# Altium schematic sheet CPLD.SchDoc: {Наименование}
size 420 x 297 mm; DocumentNumber: НРДЦ.ХХХХХХ.ХХХ ХХ; SheetNumber: {}; SheetTotal: {}; PageSetup: Record=PageOptions|CenterHorizontal=False|CenterVertical=False|PrintScale=0.95|XCorrection=0.00|YCorrection=0.00|PrintKind=1|BorderSize=5000000|LeftOffset=0|BottomOffset=0|Orientation=1|PaperLength=1000|PaperWidth=1000|Scale=100|PaperSource=15|PrintQuality=600|MediaType=1|DitherType=10|PaperKind=A4|PrintScaleMode=1; Rule: PcbType=ProtelPcb
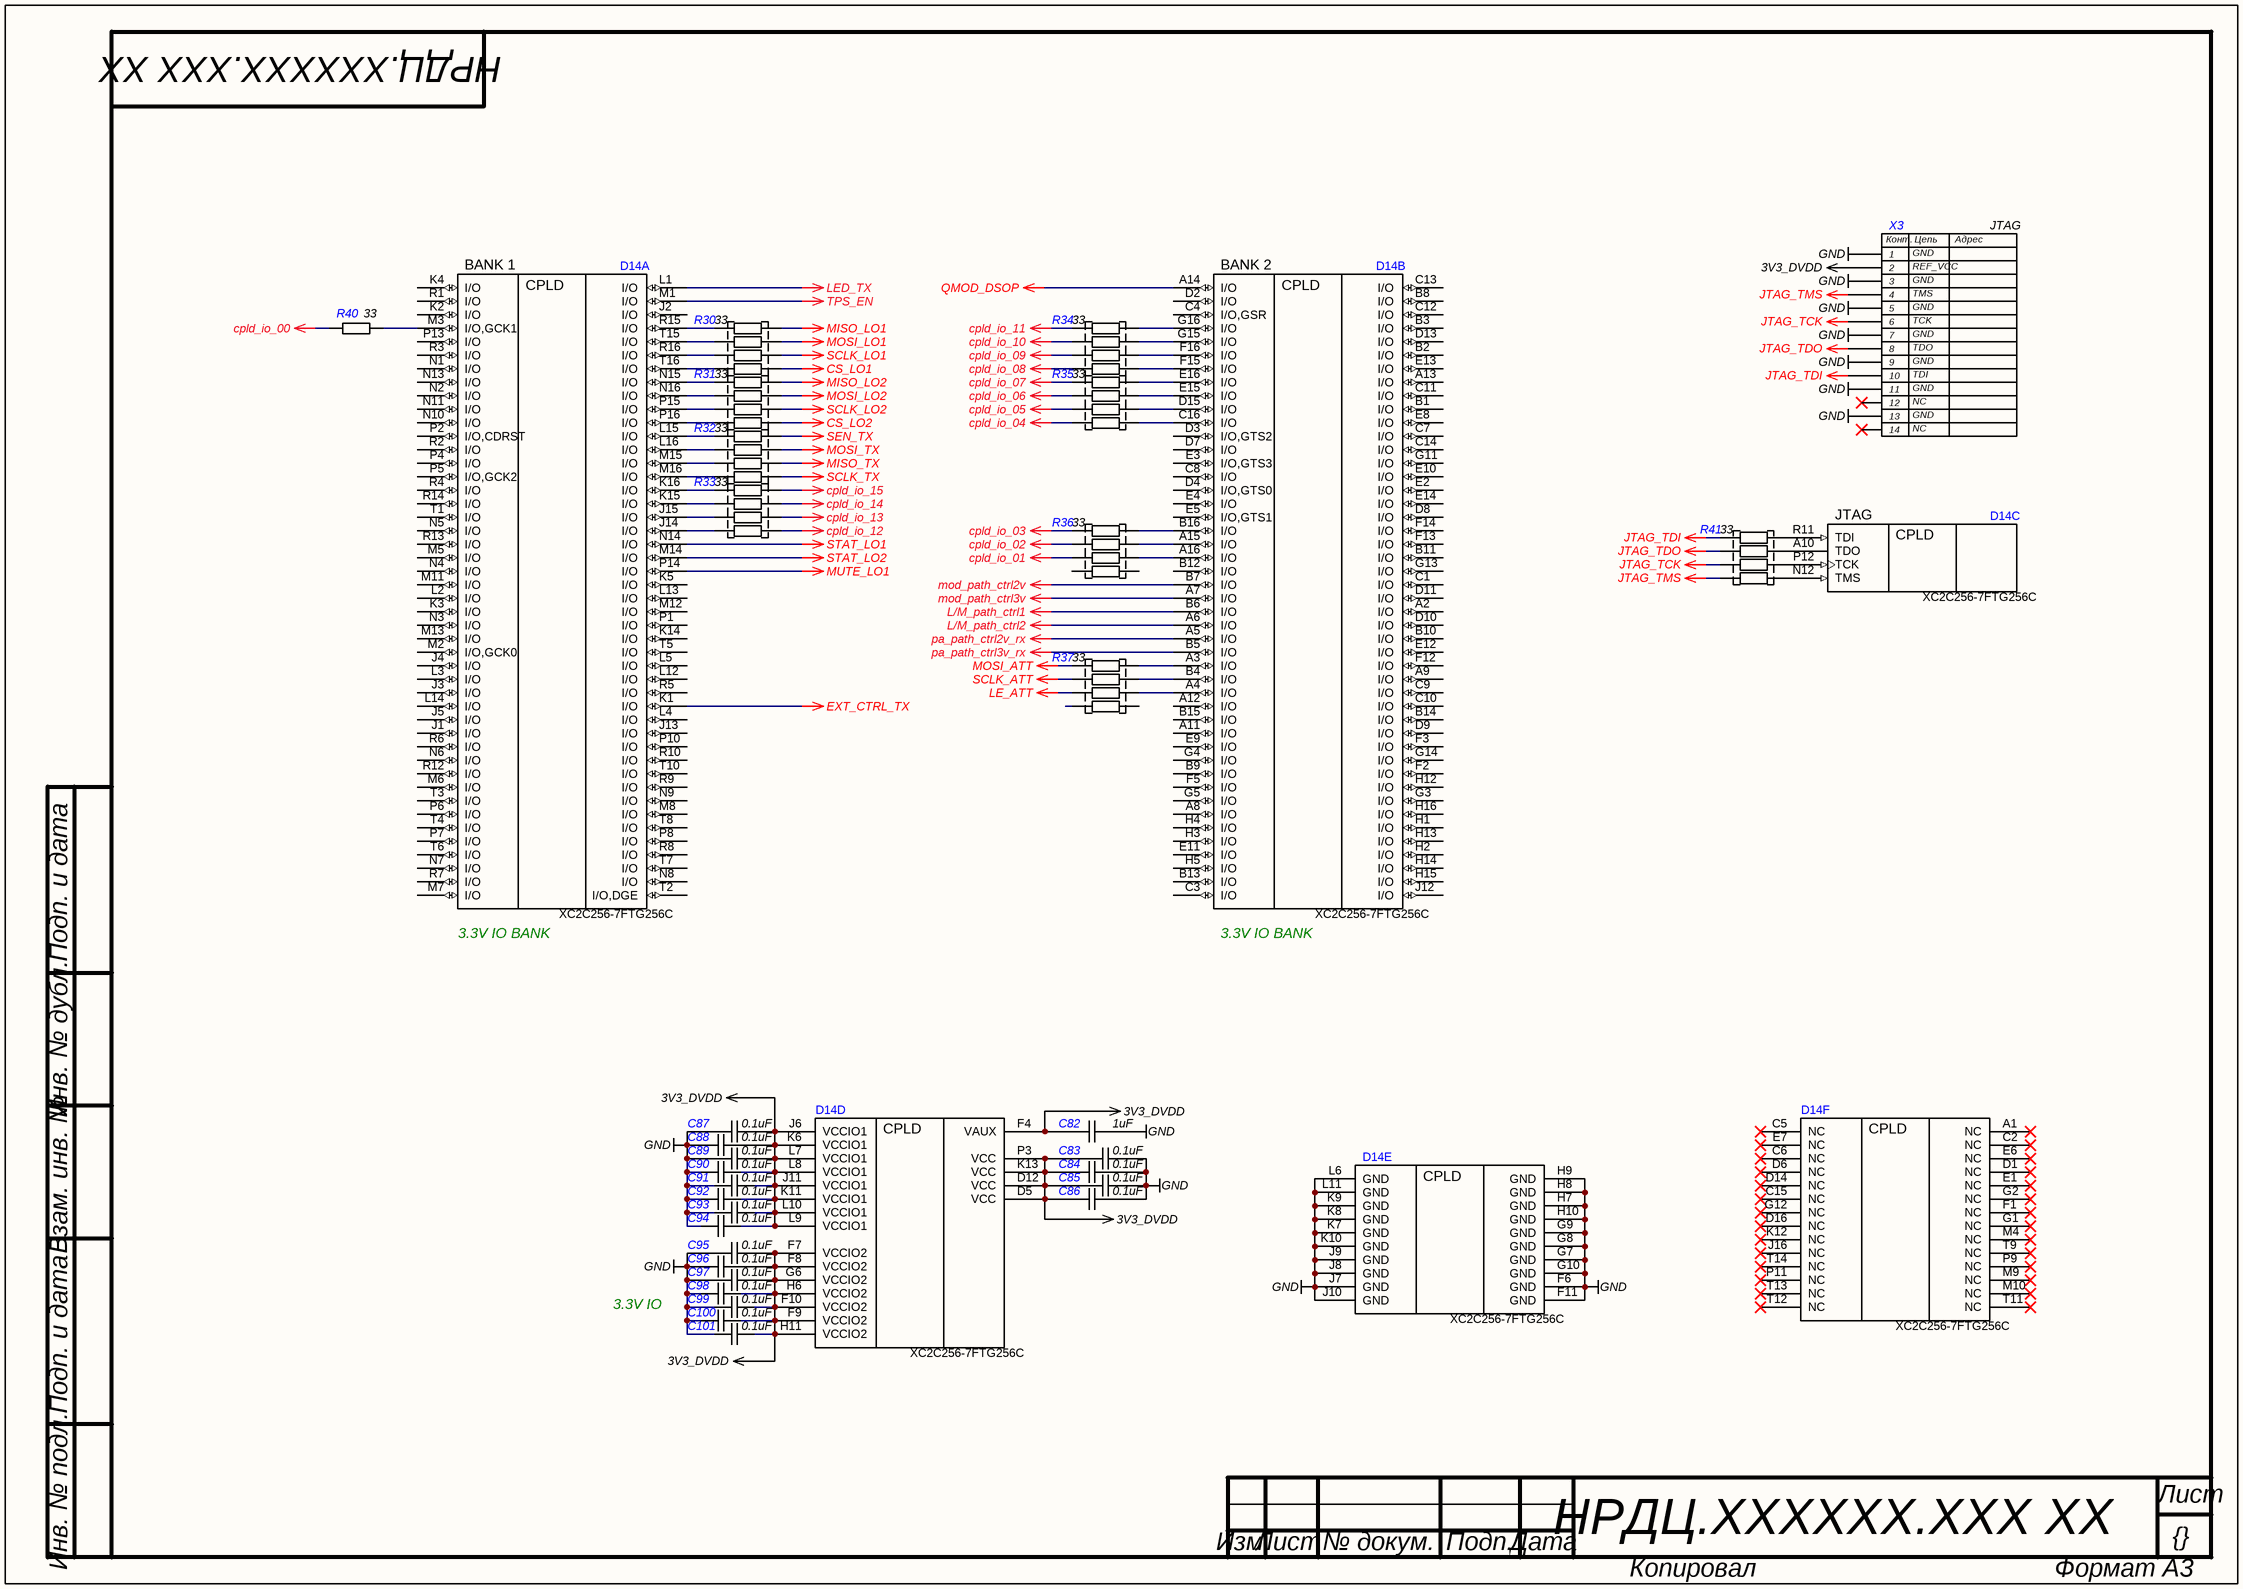
[diagram p0: CPLD.SchDoc]

## Parts
C82  value 1uF  [C0402]  (hidden comment: CAP)
C83  value 0.1uF  [C0402]  (hidden comment: CAP)
C84  value 0.1uF  [C0402]  (hidden comment: CAP)
C85  value 0.1uF  [C0402]  (hidden comment: CAP)
C86  value 0.1uF  [C0402]  (hidden comment: CAP)
C87  value 0.1uF  [C0402]  (hidden comment: CAP)
C88  value 0.1uF  [C0402]  (hidden comment: CAP)
C89  value 0.1uF  [C0402]  (hidden comment: CAP)
C90  value 0.1uF  [C0402]  (hidden comment: CAP)
C91  value 0.1uF  [C0402]  (hidden comment: CAP)
C92  value 0.1uF  [C0402]  (hidden comment: CAP)
C93  value 0.1uF  [C0402]  (hidden comment: CAP)
C94  value 0.1uF  [C0402]  (hidden comment: CAP)
C95  value 0.1uF  [C0402]  (hidden comment: CAP)
C96  value 0.1uF  [C0402]  (hidden comment: CAP)
C97  value 0.1uF  [C0402]  (hidden comment: CAP)
C98  value 0.1uF  [C0402]  (hidden comment: CAP)
C99  value 0.1uF  [C0402]  (hidden comment: CAP)
C100  value 0.1uF  [C0402]  (hidden comment: CAP)
C101  value 0.1uF  [C0402]  (hidden comment: CAP)
D14  XC2C256-7FTG256C  [FTG256]  (parts A,B,C,D,E,F of 6)
R30  value 33  [EXN8V]  (hidden comment: RES 4x0402)
R31  value 33  [EXN8V]  (hidden comment: RES 4x0402)
R32  value 33  [EXN8V]  (hidden comment: RES 4x0402)
R33  value 33  [EXN8V]  (hidden comment: RES 4x0402)
R34  value 33  [EXN8V]  (hidden comment: RES 4x0402)
R35  value 33  [EXN8V]  (hidden comment: RES 4x0402)
R36  value 33  [EXN8V]  (hidden comment: RES 4x0402)
R37  value 33  [EXN8V]  (hidden comment: RES 4x0402)
R40  value 33  [R0402]  (hidden comment: RES)
R41  value 33  [EXN8V]  (hidden comment: RES 4x0402)
X3  JTAG  [JTAG Mail 2mm]

## Nets
3V3_DVDD: C82.1 C83.1 C84.1 C85.1 C86.1 C87.2 C88.2 C89.2 C90.2 C91.2 C92.2 C93.2 C94.2 C95.2 C96.2 C97.2 C98.2 C99.2 C100.2 C101.2 D14.D5(VCC) D14.D12(VCC) D14.F4(VAUX) D14.F7(VCCIO2) D14.F8(VCCIO2) D14.F9(VCCIO2) D14.F10(VCCIO2) D14.G6(VCCIO2) D14.H6(VCCIO2) D14.H11(VCCIO2) D14.J6(VCCIO1) D14.J11(VCCIO1) D14.K6(VCCIO1) D14.K11(VCCIO1) D14.K13(VCC) D14.L7(VCCIO1) D14.L8(VCCIO1) D14.L9(VCCIO1) D14.L10(VCCIO1) D14.P3(VCC) X3.2
cpld_io_00: R40.2
cpld_io_01: R36.7
cpld_io_02: R36.6
cpld_io_03: R36.5
cpld_io_04: R35.8
cpld_io_05: R35.7
cpld_io_06: R35.6
cpld_io_07: R35.5
cpld_io_08: R34.8
cpld_io_09: R34.7
cpld_io_10: R34.6
cpld_io_11: R34.5
cpld_io_12: R33.8
cpld_io_13: R33.7
cpld_io_14: R33.6
cpld_io_15: R33.5
CS_LO1: R30.5
CS_LO2: R31.5
EXT_CTRL_TX: D14.K1(I/O)
GND: C82.2 C83.2 C84.2 C85.2 C86.2 C87.1 C88.1 C89.1 C90.1 C91.1 C92.1 C93.1 C94.1 C95.1 C96.1 C97.1 C98.1 C99.1 C100.1 C101.1 D14.F6(GND) D14.F11(GND) D14.G7(GND) D14.G8(GND) D14.G9(GND) D14.G10(GND) D14.H7(GND) D14.H8(GND) D14.H9(GND) D14.H10(GND) D14.J7(GND) D14.J8(GND) D14.J9(GND) D14.J10(GND) D14.K7(GND) D14.K8(GND) D14.K9(GND) D14.K10(GND) D14.L6(GND) D14.L11(GND) X3.1 X3.3 X3.5 X3.7 X3.9 X3.11 X3.13
JTAG_TCK: R41.6 X3.6
JTAG_TDI: R41.8 X3.10
JTAG_TDO: R41.7 X3.8
JTAG_TMS: R41.5 X3.4
L/M_path_ctrl1: D14.B6(I/O)
L/M_path_ctrl2: D14.A6(I/O)
LE_ATT: R37.6
LED_TX: D14.L1(I/O)
MISO_LO1: R30.8
MISO_LO2: R31.8
MISO_TX: R32.6
mod_path_ctrl2v: D14.B7(I/O)
mod_path_ctrl3v: D14.A7(I/O)
MOSI_ATT: R37.8
MOSI_LO1: R30.7
MOSI_LO2: R31.7
MOSI_TX: R32.7
MUTE_LO1: D14.P14(I/O)
pa_path_ctrl2v_rx: D14.A5(I/O)
pa_path_ctrl3v_rx: D14.B5(I/O)
QMOD_DSOP: D14.A14(I/O)
SCLK_ATT: R37.7
SCLK_LO1: R30.6
SCLK_LO2: R31.6
SCLK_TX: R32.5
SEN_TX: R32.8
STAT_LO1: D14.N14(I/O)
STAT_LO2: D14.M14(I/O)
TPS_EN: D14.M1(I/O)
NetD14_A3: D14.A3(I/O) R37.1
NetD14_A4: D14.A4(I/O) R37.3
NetD14_A10: D14.A10(TDO) R41.2
NetD14_A15: D14.A15(I/O) R36.3
NetD14_A16: D14.A16(I/O) R36.2
NetD14_B4: D14.B4(I/O) R37.2
NetD14_B16: D14.B16(I/O) R36.4
NetD14_C16: D14.C16(I/O) R35.1
NetD14_D15: D14.D15(I/O) R35.2
NetD14_E15: D14.E15(I/O) R35.3
NetD14_E16: D14.E16(I/O) R35.4
NetD14_F15: D14.F15(I/O) R34.1
NetD14_F16: D14.F16(I/O) R34.2
NetD14_G15: D14.G15(I/O) R34.3
NetD14_G16: D14.G16(I/O) R34.4
NetD14_J14: D14.J14(I/O) R33.1
NetD14_J15: D14.J15(I/O) R33.2
NetD14_K15: D14.K15(I/O) R33.3
NetD14_K16: D14.K16(I/O) R33.4
NetD14_L15: D14.L15(I/O) R32.1
NetD14_L16: D14.L16(I/O) R32.2
NetD14_M3: D14.M3(I/O,GCK1) R40.1
NetD14_M15: D14.M15(I/O) R32.3
NetD14_M16: D14.M16(I/O) R32.4
NetD14_N12: D14.N12(TMS) R41.4
NetD14_N15: D14.N15(I/O) R31.1
NetD14_N16: D14.N16(I/O) R31.2
NetD14_P12: D14.P12(TCK) R41.3
NetD14_P15: D14.P15(I/O) R31.3
NetD14_P16: D14.P16(I/O) R31.4
NetD14_R11: D14.R11(TDI) R41.1
NetD14_R15: D14.R15(I/O) R30.1
NetD14_R16: D14.R16(I/O) R30.2
NetD14_T15: D14.T15(I/O) R30.3
NetD14_T16: D14.T16(I/O) R30.4

Not connected (* = marked no-connect by the designer): D14 A1(NC)* A2(I/O) A8(I/O) A9(I/O) A11(I/O) A12(I/O) A13(I/O) B1(I/O) B2(I/O) B3(I/O) B8(I/O) B9(I/O) B10(I/O) B11(I/O) B12(I/O) B13(I/O) B14(I/O) B15(I/O) C1(I/O) C2(NC)* C3(I/O) C4(I/O,GSR) C5(NC)* C6(NC)* C7(I/O) C8(I/O) C9(I/O) C10(I/O) C11(I/O) C12(I/O) C13(I/O) C14(I/O) C15(NC)* D1(NC)* D2(I/O) D3(I/O,GTS2) D4(I/O,GTS0) D6(NC)* D7(I/O) D8(I/O) D9(I/O) D10(I/O) D11(I/O) D13(I/O) D14(NC)* D16(NC)* E1(NC)* E2(I/O) E3(I/O,GTS3) E4(I/O) E5(I/O,GTS1) E6(NC)* E7(NC)* E8(I/O) E9(I/O) E10(I/O) E11(I/O) E12(I/O) E13(I/O) E14(I/O) F1(NC)* F2(I/O) F3(I/O) F5(I/O) F12(I/O) F13(I/O) F14(I/O) G1(NC)* G2(NC)* G3(I/O) G4(I/O) G5(I/O) G11(I/O) G12(NC)* G13(I/O) G14(I/O) H1(I/O) H2(I/O) H3(I/O) H4(I/O) H5(I/O) H12(I/O) H13(I/O) H14(I/O) H15(I/O) H16(I/O) J1(I/O) J2(I/O) J3(I/O) J4(I/O) J5(I/O) J12(I/O) J13(I/O) J16(NC)* K2(I/O) K3(I/O) K4(I/O) K5(I/O) K12(NC)* K14(I/O) L2(I/O) L3(I/O) L4(I/O) L5(I/O) L12(I/O) L13(I/O) L14(I/O) M2(I/O,GCK0) M4(NC)* M5(I/O) M6(I/O) M7(I/O) M8(I/O) M9(NC)* M10(NC)* M11(I/O) M12(I/O) M13(I/O) N1(I/O) N2(I/O) N3(I/O) N4(I/O) N5(I/O) N6(I/O) N7(I/O) N8(I/O) N9(I/O) N10(I/O) N11(I/O) N13(I/O) P1(I/O) P2(I/O,CDRST) P4(I/O) P5(I/O,GCK2) P6(I/O) P7(I/O) P8(I/O) P9(NC)* P10(I/O) P11(NC)* P13(I/O) R1(I/O) R2(I/O) R3(I/O) R4(I/O) R5(I/O) R6(I/O) R7(I/O) R8(I/O) R9(I/O) R10(I/O) R12(I/O) R13(I/O) R14(I/O) T1(I/O) T2(I/O,DGE) T3(I/O) T4(I/O) T5(I/O) T6(I/O) T7(I/O) T8(I/O) T9(NC)* T10(I/O) T11(NC)* T12(NC)* T13(NC)* T14(NC)*; R36 1 8; R37 4 5; X3 12* 14*

## Notes on the sheet
- (near X3) GND
- (near X3) REF_VCC
- (near X3) TMS
- (near X3) TCK
- (near X3) TDO
- (near X3) TDI
- (near X3) NC
- (near D14) 3.3V IO BANK
- 3.3V IO
- Подп. и дата
- Инв. № дубл.
- Взам. инв. №
- Инв. № подл.
- Лист
- Изм.
- № докум.
- Подп.
- Дата
- Копировал
- Формат А3
- (in symbol HDR Debug_14-pin) Конт.; Цепь; Адрес
- (in symbol XC2C256-7FTG256C, part A) BANK 1
- (in symbol XC2C256-7FTG256C, part B) BANK 2
- (in symbol XC2C256-7FTG256C, part C) JTAG

## Library data of the parts
C82 = CAP: SMD Capacitor; Manufacturer: Murata; Material: X7R; Tolerance: 10%; Voltage: 6.3V; Type: Ceramic Capacitor; P/N: GRM155R70J105KA12J; Supplier 1: Digi-key; Supplier Part Number 1: 490-13339-1-ND; Supplier 2: Mouser; Supplier Part Number 2: 81-GRM155R70J105KA2J; Supplier 3: Farnell; Supplier Part Number 3: *
C83-C101 = CAP: SMD Capacitor; Manufacturer: Murata; Material: X7R; Tolerance: 10%; Voltage: 10V; Type: Ceramic Capacitor; P/N: GRM155R71A104KA01J; Supplier 1: Digi-key; Supplier Part Number 1: 490-6322-1-ND; Supplier 2: Mouser; Supplier Part Number 2: 81-GRM155R71A104KA1J; Supplier 3: Farnell; Supplier Part Number 3: *
D14 = XC2C256-7FTG256C: CoolRunner-II 1.8V, 256 Macrocell CPLD, 184 User I/Os, 256-Ball FTBGA, Commercial Grade, Pb-Free; Code_JEDEC: MS-034-AAF-1*; PackageVersion: ver1.3, Oct-2007; PackageReference: FTG256; PackageDescription: 256-Ball Fine Pitch Thin Ball Grid Array 1.00 mm Pitch (FTG256) - Pb-Free; DatasheetVersion: ver3.2, Mar-2007; PartNumber: XC2C256-7FTG256C; P/N: XC2C256-7FTG256C; Name: XC2C256-7FTG256C; Type: CPLD; Supplier 1: Digi-key; Supplier Part Number 1: 122-1400-ND; Supplier 2: Mouser; Supplier Part Number 2: 217-XC2C256-7FTG256C; Supplier 3: Farnell; Supplier Part Number 3: *
R30-R37 R41 = RES 4x0402: Chip Resistor Array; Manufacturer: Panasonic; Name: EXBN8V; Number of Resistors: 4; Tolerance: 5%; P/N: ERJ-2GEJ330X; Type: 0402 Array Concave Terminal; Number of Terminals: 8; Series: EXB; Supplier 1: Digi-key; Supplier Part Number 1: Y10330CT-ND; Supplier 2: Mouser; Supplier Part Number 2: 667-EXB-N8V330JX; Supplier 3: Farnell; Supplier Part Number 3: *; Supplier 4: Digi-key; Supplier Part Number 4: *; Supplier 5: Mouser; Supplier Part Number 5: *; Supplier 6: Farnell; Supplier Part Number 6: *
R40 = RES: SMD Resistor; Name: Chip SMD Resistor; Power: 0.1 Wt; Tolerance: 1%; P/N: ERJ-2RKF33R0X; Temperature Range: -55…155°C; Supplier 1: Digi-key; Supplier Part Number 1: P33.0LCT-ND; Supplier 2: Mouser; Supplier Part Number 2: 667-ERJ-2RKF33R0X; Supplier 3: Farnell; Supplier Part Number 3: *
X3 = HDR Debug_14-pin: 2.00mm Pitch, Milli-Grid PCB Header, Dual Row, Vertical, Through Hole, Shrouded, 14 / Circuits; Manufacturer: Molex; Name: Milli-Grid Connector System; P/N: 878311421; Type: 2.00mm Pitch, Milli-Grid PCB Header, Dual Row, Vertical, Through Hole, Shrouded, 14; Series: 87831; Supplier 1: Digi-key; Supplier Part Number 1: WM4224-ND; Supplier 2: Mouser; Supplier Part Number 2: 538-87831-1421; Supplier 3: Farnell; Supplier Part Number 3: *